# EAGLE design BlinkMuinoTwig (EAGLE 5.11)
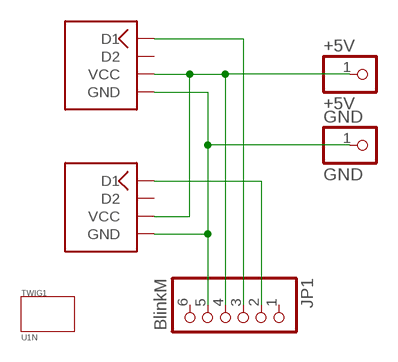
[diagram p0: schematic, sheet 1]

## Parts
+5V  +5V  PINHD-1X1  [1X01]
GND  GND  PINHD-1X1  [1X01]
JP1  BlinkM  PINHD-1X6LOCK  [1X06-BIGLOCK]
TWIG1  U1N  [U1N]
U$1  TWIG-4PIN  [TWIG-4PIN-L]
U$2  TWIG-4PIN  [TWIG-4PIN-L]

## Nets
GND: GND.1 JP1.5 U$1.GND U$2.GND
N$3: JP1.3 U$1.D1
N$4: JP1.2 U$2.D1
VCC: +5V.1 JP1.4 U$1.VCC U$2.VCC
Unconnected: JP1.1 JP1.6 U$1.D2 U$2.D2

## Library data of the parts
+5V GND = adafruit:PINHD-1X1: Pin header 1x1 for 0.1" spacing With round pins
JP1 = adafruit:PINHD-1X6: PIN HEADER
TWIG1 = twig_template1:U1N
U$1 U$2 = kotobuki:TWIG-4PIN

## Board
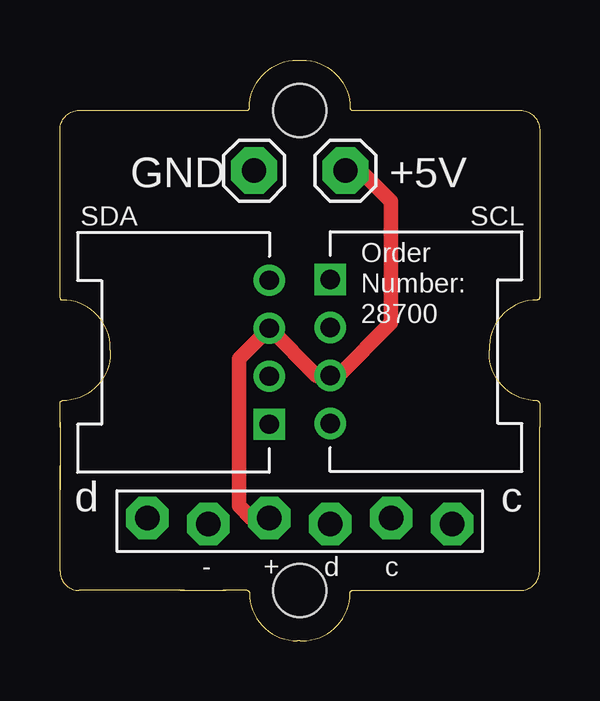
[diagram p1: board, top side]
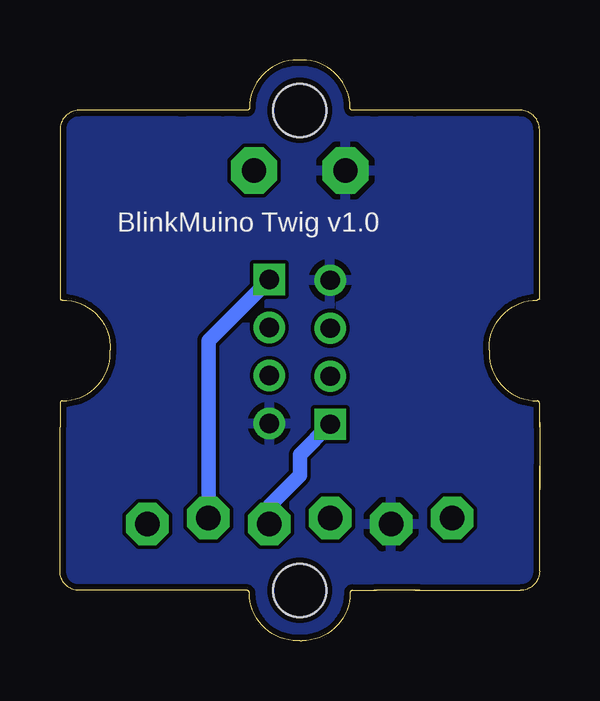
[diagram p2: board, bottom side, seen from below]

Size 20 x 24.2 mm. Coordinates in mm from the lower left corner, seen from the top.
Copper layers (1*16): Top 0.035mm / dielectric 1.5mm / Bottom 0.035mm
Design rules "Fusion_eagle_rule_v1.1": minimum track width 6mil, minimum drill 12mil, track to track 6mil, track to pad 6mil, pad to pad 6mil, via to via 6mil, smd to smd 0mil, copper to edge 10mil, drill to drill 10mil, minimum pad ring 10mil, minimum via ring 6mil, stop-mask expansion 2mil, vias tented up to drill 100mil, thermal gap 10mil

### Footprints (pad centres in the part's own frame; a part is rotated, then mirrored left to right if it is on the bottom)
1X01 = drill 1.016 pad 1.93 octagon: 1 0,0
1X06-BIGLOCK = drill 1.016 pad 1.778 octagon: 1 -6.35,0.127; 2 -3.81,-0.127; 3 -1.27,0.127; 4 1.27,-0.127; 5 3.81,0.127; 6 6.35,-0.127
U1N = hole 2.2: 0,-10; 0,10
TWIG-4PIN-L = drill 0.8 square: D1 0,-6 | drill 0.8 round: D2 0,-4; GND 0,0; VCC 0,-2

### Placement (x,y rotation side)
+5V  11.9,19.59 0 top
GND  8.09,19.59 0 top
JP1  10,4.99 180 top
TWIG1  10,12.1 0 top
U$1  8.73,15.02 0 top
U$2  11.27,9.05 180 top

### Tracks (layer width: path | path; a pad name or v marks a point on that pad's centre or on a via)
GND
  pour Bottom: -1.43,25.94 21.43,25.94 21.43,-0.73 -1.43,-0.73
N$3
  Bottom 0.61: JP1.3 11.27,5.62 10,6.89 10,7.75 U$1.D1
N$4
  Bottom 0.61: JP1.2 13.81,12.51 U$2.D1
VCC
  Top 0.61: +5V.1 12.54,19.59 13.81,18.32 13.81,13.24 11.62,11.05 U$2.VCC 10.7,11.05 U$1.VCC 7.46,11.75 7.46,5.62 7.97,5.11 JP1.4

### Text on the board
tNames: SDA | SCL | Order | Number: | 28700 | d | c | - | + | d | c
bNames: BlinkMuino Twig v1.0